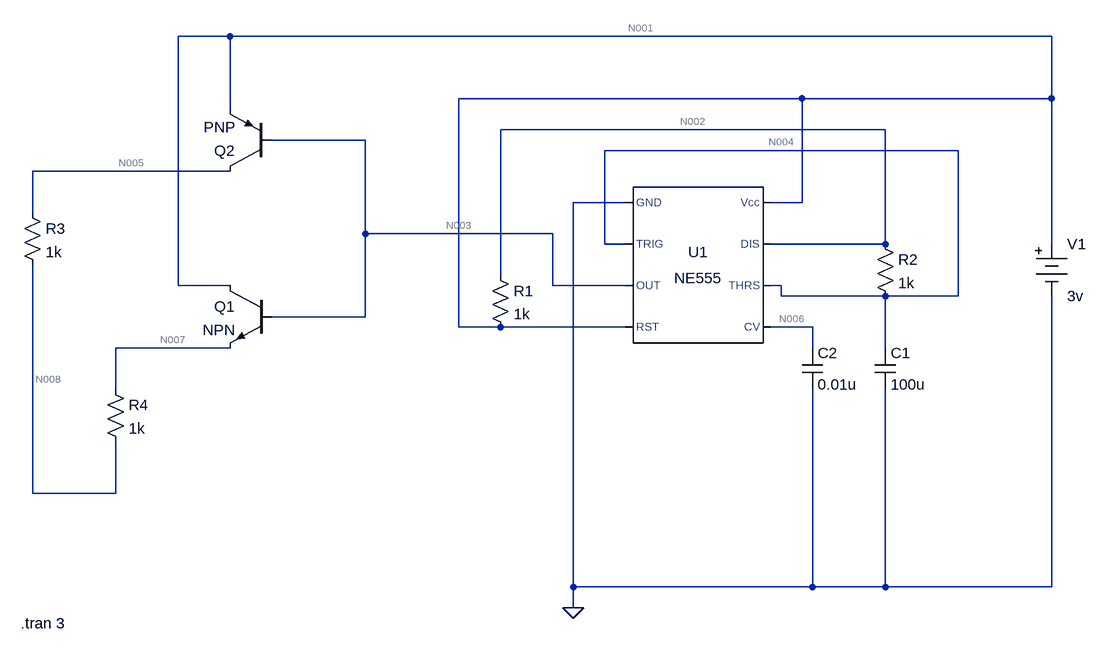
[diagram p0: schematic D-11_v-1-0_e-1_LMC555+PNP+NPN__v-1.0-e-1-a1.asc]
D-11_v-1-0_e-1_LMC555+PNP+NPN__v-1.0-e-1-a1.asc, the LTspice schematic file:
Version 4
SHEET 1 880 740
WIRE -512 -192 -592 -192
WIRE 752 -192 -512 -192
WIRE 368 -96 -160 -96
WIRE 752 -96 752 -192
WIRE 752 -96 368 -96
WIRE -512 -80 -512 -192
WIRE 496 -48 -96 -48
WIRE -304 -32 -448 -32
WIRE 608 -16 64 -16
WIRE -512 16 -816 16
WIRE 96 64 16 64
WIRE 368 64 368 -96
WIRE 368 64 320 64
WIRE -816 80 -816 16
WIRE -304 112 -304 -32
WIRE -16 112 -304 112
WIRE 64 128 64 -16
WIRE 96 128 64 128
WIRE 496 128 496 -48
WIRE 496 128 320 128
WIRE 752 128 752 -96
WIRE -96 176 -96 -48
WIRE -592 192 -592 -192
WIRE -512 192 -592 192
WIRE -16 192 -16 112
WIRE 96 192 -16 192
WIRE 336 192 320 192
WIRE 336 208 336 192
WIRE 496 208 336 208
WIRE 608 208 608 -16
WIRE 608 208 496 208
WIRE -304 240 -304 112
WIRE -304 240 -448 240
WIRE -160 256 -160 -96
WIRE -96 256 -160 256
WIRE 96 256 -96 256
WIRE 384 256 320 256
WIRE -512 288 -688 288
WIRE 384 288 384 256
WIRE 496 288 496 208
WIRE -688 352 -688 288
WIRE -816 512 -816 160
WIRE -688 512 -688 432
WIRE -688 512 -816 512
WIRE 16 656 16 64
WIRE 384 656 384 352
WIRE 384 656 16 656
WIRE 496 656 496 352
WIRE 496 656 384 656
WIRE 752 656 752 208
WIRE 752 656 496 656
WIRE 16 688 16 656
FLAG 16 688 0
SYMBOL Misc\\NE555 208 160 R0
SYMATTR InstName U1
SYMBOL res -112 160 R0
SYMATTR InstName R1
SYMATTR Value 1k
SYMBOL res 480 112 R0
SYMATTR InstName R2
SYMATTR Value 1k
SYMBOL cap 480 288 R0
SYMATTR InstName C1
SYMATTR Value 100u
SYMBOL cap 368 288 R0
SYMATTR InstName C2
SYMATTR Value 0.01u
SYMBOL Misc\\battery 752 112 R0
SYMATTR InstName V1
SYMATTR Value 3v
SYMBOL npn -448 192 M0
SYMATTR InstName Q1
SYMBOL res -704 336 R0
SYMATTR InstName R4
SYMATTR Value 1k
SYMBOL pnp -448 16 R180
SYMATTR InstName Q2
SYMBOL res -832 64 R0
SYMATTR InstName R3
SYMATTR Value 1k
TEXT -834 712 Left 2 !.tran 3

The netlist it stands for:
* D-11_v-1-0_e-1_LMC555+PNP+NPN__v-1.0-e-1-a1.asc
XU1 0 N004 N003 N001 N006 N004 N002 N001 NE555  ; pins GND TRIG OUT RST CV THRS DIS Vcc
R1 N002 N001 1k
R2 N002 N004 1k
C1 N004 0 100u
C2 N006 0 0.01u
V1 N001 0 3v
Q1 N001 N003 N007 0 NPN
R4 N007 N008 1k
Q2 N005 N003 N001 0 PNP
R3 N005 N008 1k
.model NPN NPN
.model PNP PNP
.lib standard.bjt
.tran 3
.lib NE555.sub
.backanno
.end

* Results of the author's LTspice run, read from the files saved beside the schematic
* Operating Point, zero values left out:
*   V(n004) = 3 V
*   V(n006) = 2 V
*   V(n001) = 3 V
*   V(n002) = 3 V
*   V(n003) = 3 V
*   V(n007) = 3 V
*   V(n008) = 3 V
*   V(n005) = 3 V
*   I(R2) = 6 nA
*   I(R1) = -10 nA
*   I(V1) = -962.3 µA
*   Ix(u1:1) = -962.3 µA
*   Ix(u1:2) = 3 nA
*   Ix(u1:4) = 9.333 µA
*   Ix(u1:6) = 3 nA
*   Ix(u1:7) = 4.003 nA
*   Ix(u1:8) = 953 µA
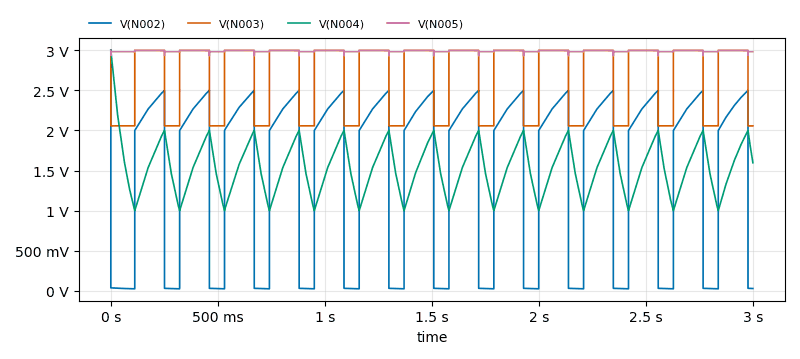
[diagram p1: Transient Analysis of D-11_v-1-0_e-1_LMC555+PNP+NPN__v-1.0-e-1-a1.asc, plotted from the saved traces]
* Transient Analysis, 1 run:
*   V(N002): min 23.71 mV, max 3 V, average 1.483 V, rms 1.836 V, last 27.25 mV
*   V(N003): min 2.057 V, max 3 V, average 2.668 V, rms 2.706 V, last 2.057 V
*   V(N004): min 999 mV, max 3 V, average 1.531 V, rms 1.573 V, last 1.597 V
*   V(N005): min 2.932 V, max 3 V, average 2.994 V, rms 2.994 V, last 2.982 V